# EAGLE design Papaiz (EAGLE 8.3.2)
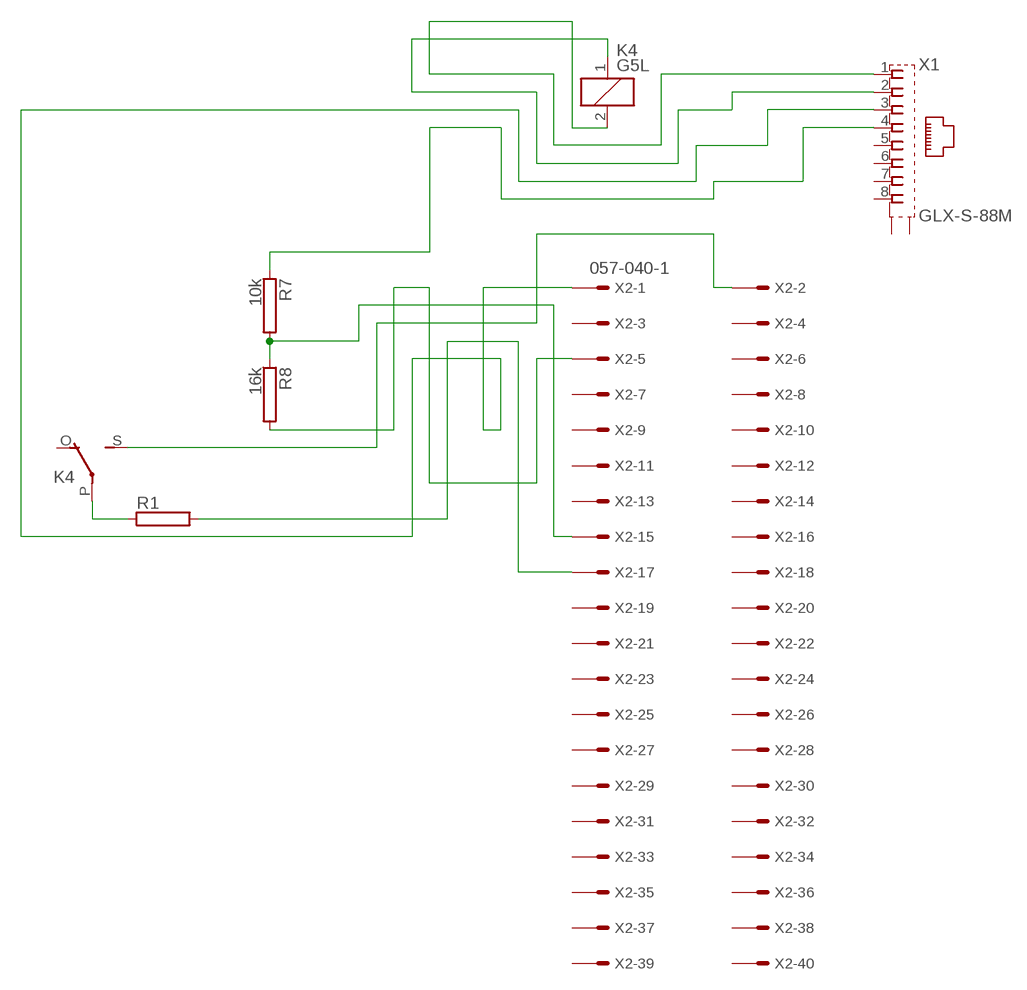
[diagram p0: schematic, sheet 1]

## Parts
K4  G5L  [G5LE]
R1  RAC01  [AC01]
R7  10k  RAC01  [AC01]
R8  16k  RAC01  [AC01]
X1  GLX-S-88M  [GLX-S-88M]
X2  057-040-1  [057-040-1]

## Nets
N$1: K4.P(2:P) R1.1
N$2: K4.1 X1.2
N$3: R1.2 X2.17
N$8: K4.2 X1.1
N$9: K4.S(2:S) X2.2
N$17: R7.1 X1.4
N$19: R8.2 X2.5
N$21: R7.2 R8.1 X2.15
N$24: X1.3 X2.1
Unconnected: K4.O(2:O) X1.5 X1.6 X1.7 X1.8 X1.S1 X1.S2 X2.3 X2.4 X2.6 X2.7 X2.8 X2.9 X2.10 X2.11 X2.12 X2.13 X2.14 X2.16 X2.18 X2.19 X2.20 X2.21 X2.22 X2.23 X2.24 X2.25 X2.26 X2.27 X2.28 X2.29 X2.30 X2.31 X2.32 X2.33 X2.34 X2.35 X2.36 X2.37 X2.38 X2.39 X2.40

## Library data of the parts
K4 = relay:G5L: RELAY 1 x switch, 10 A/120 V AC, 8 A/30 V ADC, Omron; OC_FARNELL: unknown; OC_NEWARK: unknown
R1 R7 R8 = resistor-power:R: Power Resitor; OC_FARNELL: unknown; OC_NEWARK: unknown
X1 = con-kycon:GLX-S-88M: Mod. Jack, Right Angle, 8 posiotion, 8 contatcs RJ45 Source: GLX-S-88M.pdf; OC_FARNELL: unknown; OC_NEWARK: unknown
X2 = con-panduit:057-040-: CONNECTOR 40-pin series 057 contact pc board low profile headers; OC_FARNELL: unknown; OC_NEWARK: unknown

## Board
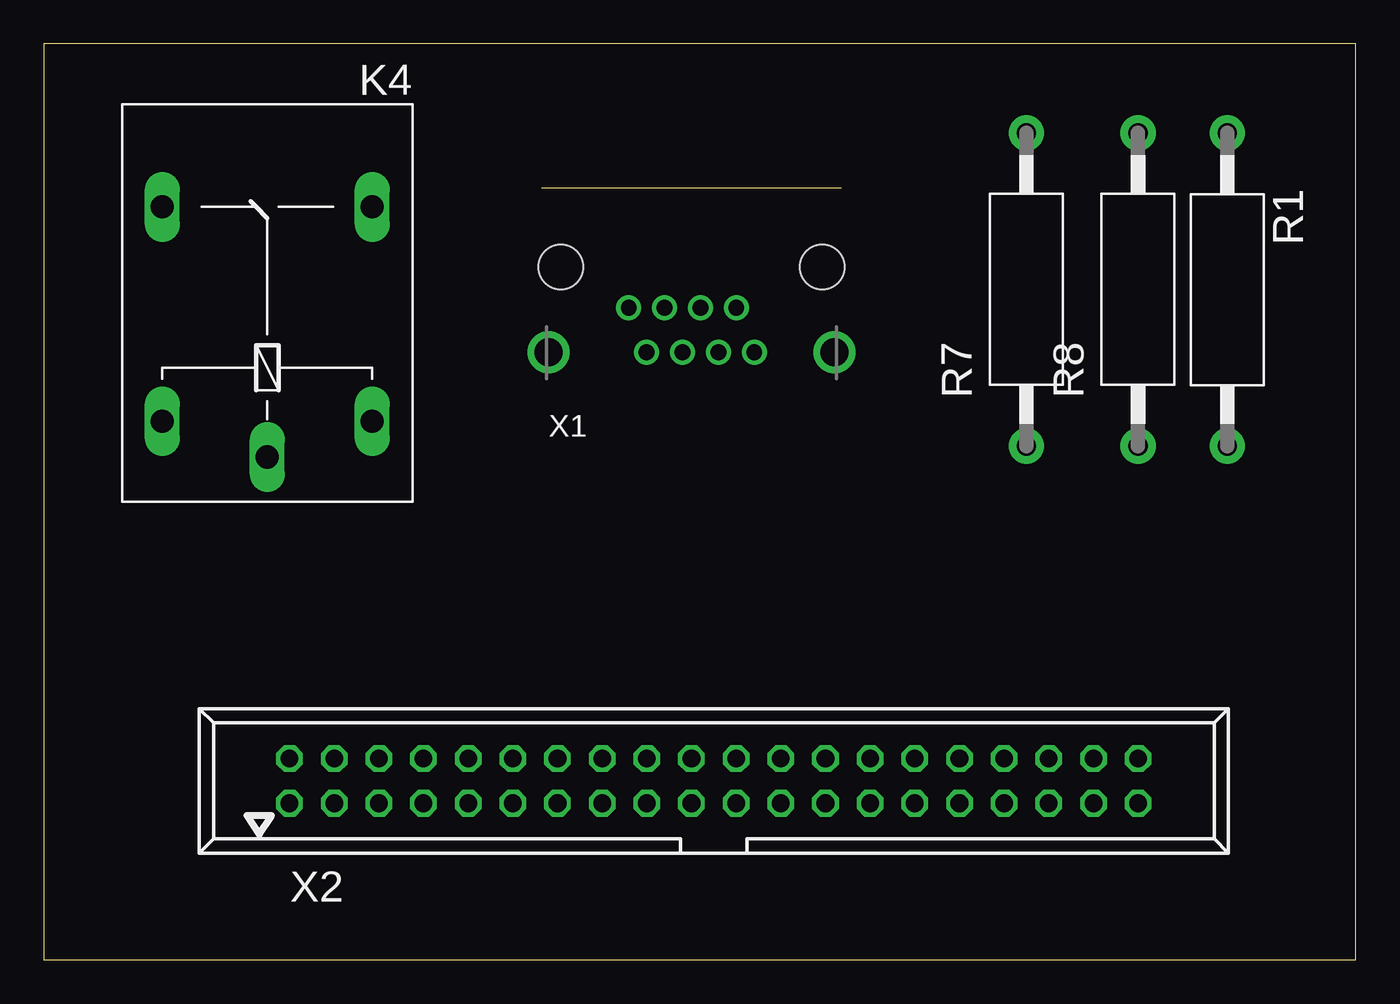
[diagram p1: board, top side]
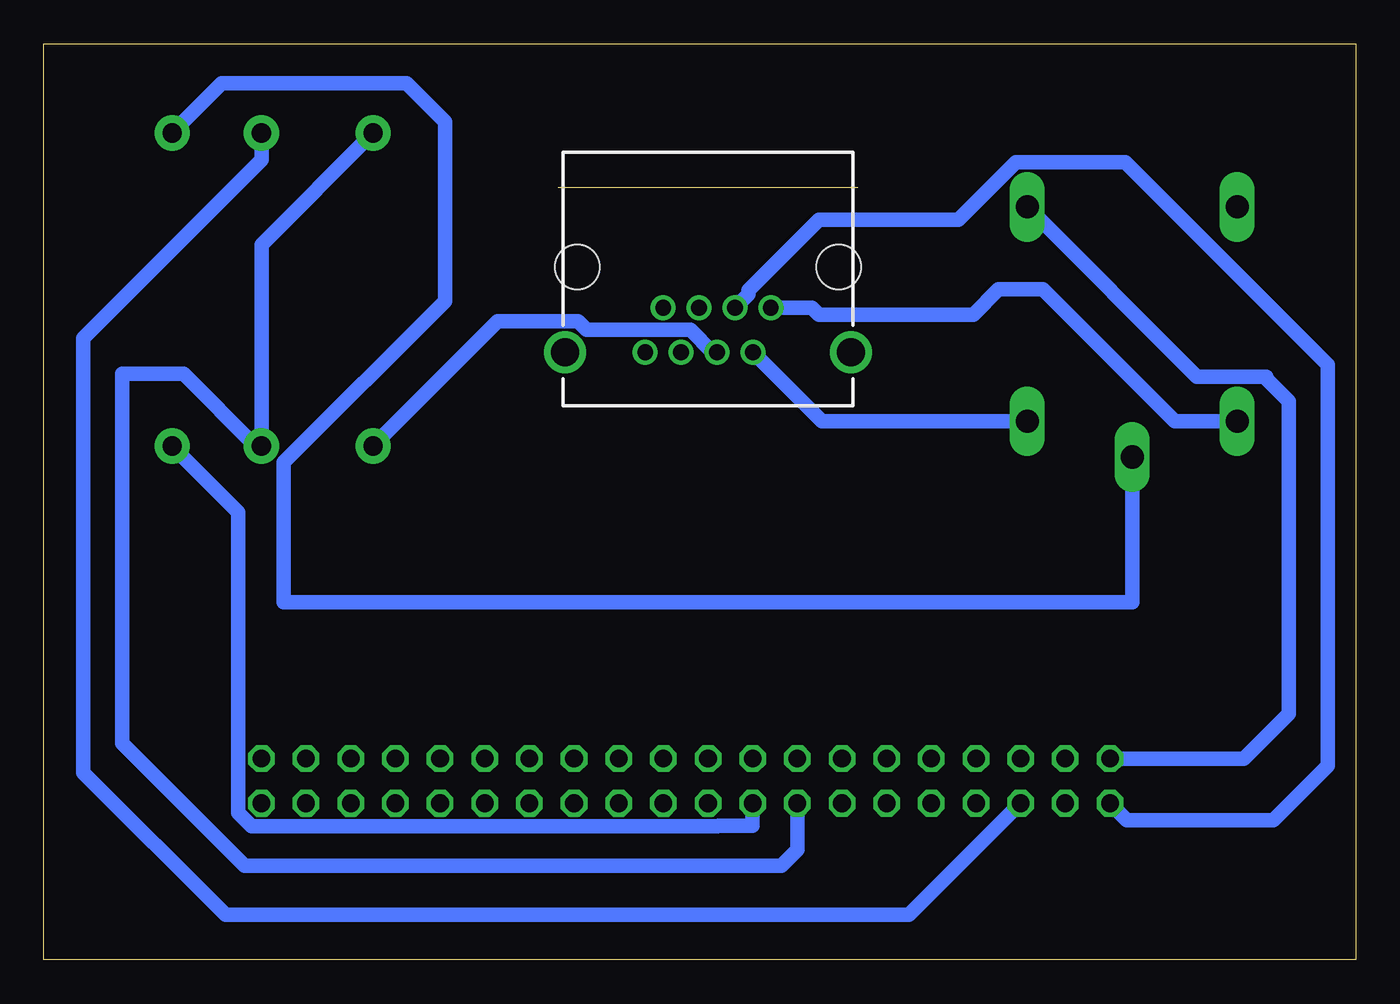
[diagram p2: board, bottom side, seen from below]

Size 74.6 x 52.06 mm. Coordinates in mm from the lower left corner, seen from the top.
Outline: 0,0 74.6,0 74.6,52.06 0,52.06 0,0
Copper layers (1*16): Top 0.035mm / dielectric 1.5mm / Bottom 0.035mm
Design rules "default": minimum track width 6mil, minimum drill 0.35mm, track to track 6mil, track to pad 6mil, pad to pad 6mil, via to via 6mil, smd to smd 6mil, copper to edge 40mil, drill to drill 6mil, minimum pad ring 10mil, minimum via ring 8mil, stop-mask expansion 4mil, vias tented up to drill 0mil, thermal gap 10mil

### Footprints (pad centres in the part's own frame; a part is rotated, then mirrored left to right if it is on the bottom)
G5LE = drill 1.321 long: 1 -7.493,-5.969; 2 -7.493,5.969; O 4.699,5.969; P -9.525,0; S 4.699,-5.969
AC01 = drill 1.1 pad 2: 1 -8.9,0; 2 8.9,0
GLX-S-88M = drill 0.9 pad 1.422: 1 -3.57,-2.3; 2 -2.55,-4.84; 3 -1.53,-2.3; 4 -0.51,-4.84; 5 0.51,-2.3; 6 1.53,-4.84; 7 2.55,-2.3; 8 3.57,-4.84 | drill 1.6 pad 2.184: S1 -8.125,-4.84; S2 8.125,-4.84 | hole 2.55: -7.44,0; 7.44,0
057-040-1 = drill 1 octagon: 1 -24.13,-1.27; 2 -24.13,1.27; 3 -21.59,-1.27; 4 -21.59,1.27; 5 -19.05,-1.27; 6 -19.05,1.27; 7 -16.51,-1.27; 8 -16.51,1.27; 9 -13.97,-1.27; 10 -13.97,1.27; 11 -11.43,-1.27; 12 -11.43,1.27; 13 -8.89,-1.27; 14 -8.89,1.27; 15 -6.35,-1.27; 16 -6.35,1.27; 17 -3.81,-1.27; 18 -3.81,1.27; 19 -1.27,-1.27; 20 -1.27,1.27; 21 1.27,-1.27; 22 1.27,1.27; 23 3.81,-1.27; 24 3.81,1.27; 25 6.35,-1.27; 26 6.35,1.27; 27 8.89,-1.27; 28 8.89,1.27; 29 11.43,-1.27; 30 11.43,1.27; 31 13.97,-1.27; 32 13.97,1.27; 33 16.51,-1.27; 34 16.51,1.27; 35 19.05,-1.27; 36 19.05,1.27; 37 21.59,-1.27; 38 21.59,1.27; 39 24.13,-1.27; 40 24.13,1.27

### Placement (x,y rotation side)
K4  12.7,38.1 90 top
R1  67.31,38.1 270 top
R7  55.88,38.1 90 top
R8  62.23,38.1 90 top
X1  36.83,39.37 0 top
X2  38.1,10.16 0 top

### Tracks (layer width: path | path; a pad name or v marks a point on that pad's centre or on a via)
N$1
  Bottom 0.813: R1.1 64.48,49.83 53.96,49.83 51.78,47.65 51.78,37.44 60.96,28.27 60.96,20.32 12.7,20.32 K4.P
N$2
  Bottom 0.813: K4.1 30.36,30.61 X1.2
N$3
  Bottom 0.813: R1.2 63.54,25.43 63.54,8.35 62.77,7.58 36.29,7.58 36.24,7.62 34.29,7.62 X2.17
N$8
  Bottom 0.813: K4.2 10.29,30.61 17.78,38.1 20.32,38.1 21.75,36.67 30.51,36.67 30.91,37.07 X1.1
N$9
  Bottom 0.152: 13.87,11.43 X2.2
  Bottom 0.813: K4.S 9.02,33.15 5.08,33.15 5.08,33.02 3.81,31.75 3.81,13.97 6.35,11.43 X2.2
N$17
  Bottom 0.152: 55.88,29.31 R7.1
  Bottom 0.813: X1.4 36.56,34.53 37.83,35.8 43.74,35.8 44.23,36.29 48.8,36.29 R7.1
N$19
  Bottom 0.152: 62.33,47.14 R8.2
  Bottom 0.813: R8.2 62.23,45.47 72.37,35.33 72.37,10.64 64.28,2.54 25.4,2.54 X2.5
N$21
  Bottom 0.813: X2.15 31.75,6.25 32.66,5.34 63.17,5.34 70.14,12.31 70.14,33.3 66.66,33.3 62.57,29.2 R8.1 62.23,40.65 R7.2
N$24
  Bottom 0.813: X2.1 13.01,7.92 4.68,7.92 1.57,11.03 1.57,33.81 13.11,45.34 19.31,45.34 22.58,42.07 30.51,42.07 34.53,38.05 34.53,37.84 X1.3